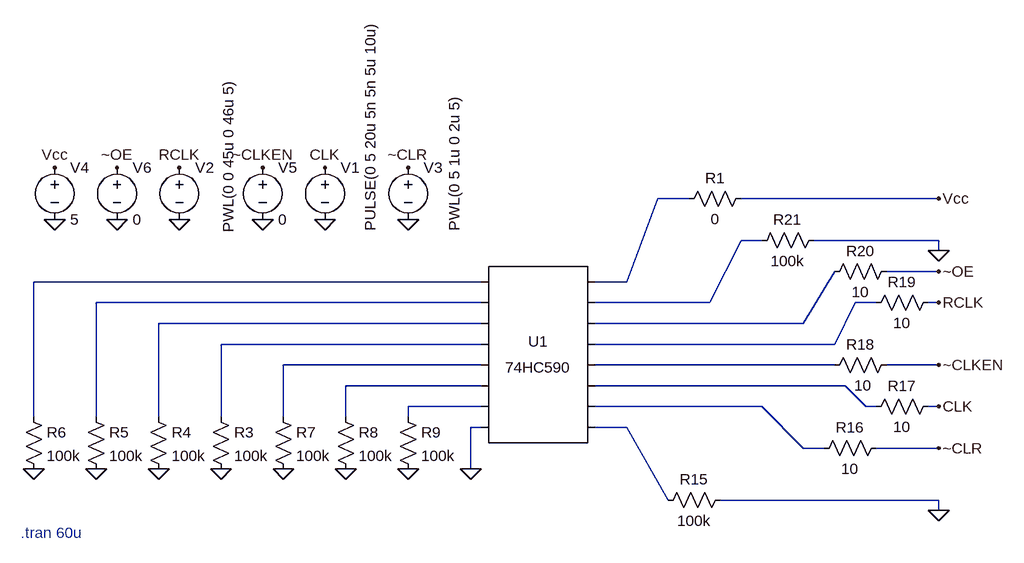
[diagram p0: schematic 74HC590_test.asc]
74HC590_test.asc, the LTspice schematic file:
Version 4
SHEET 1 1240 680
WIRE 368 -80 320 -80
WIRE 752 -80 448 -80
WIRE 480 -16 448 -16
WIRE 752 -16 560 -16
WIRE 752 0 752 -16
WIRE 752 32 672 32
WIRE 48 48 -640 48
WIRE 272 48 320 -80
WIRE 272 48 224 48
WIRE 48 80 -544 80
WIRE 400 80 448 -16
WIRE 400 80 224 80
WIRE 656 80 624 80
WIRE 752 80 736 80
WIRE 48 112 -448 112
WIRE 544 112 592 32
WIRE 544 112 224 112
WIRE 48 144 -352 144
WIRE 592 144 624 80
WIRE 592 144 224 144
WIRE 48 176 -256 176
WIRE 592 176 224 176
WIRE 752 176 672 176
WIRE 48 208 -160 208
WIRE 608 208 224 208
WIRE 48 240 -64 240
WIRE 480 240 224 240
WIRE 640 240 608 208
WIRE 656 240 640 240
WIRE 752 240 736 240
WIRE -640 256 -640 48
WIRE -544 256 -544 80
WIRE -448 256 -448 112
WIRE -352 256 -352 144
WIRE -256 256 -256 176
WIRE -160 256 -160 208
WIRE -64 256 -64 240
WIRE 48 272 32 272
WIRE 272 272 224 272
WIRE 544 304 480 240
WIRE 576 304 544 304
WIRE 752 304 656 304
WIRE 32 336 32 272
WIRE 336 384 272 272
WIRE 752 384 416 384
WIRE 752 400 752 384
FLAG -192 -48 0
FLAG -416 -48 0
FLAG -64 -48 0
FLAG -192 -128 CLK
FLAG 752 240 CLK
FLAG 752 80 RCLK
FLAG -416 -128 RCLK
FLAG 752 304 ~CLR
FLAG -64 -128 ~CLR
FLAG 752 400 0
FLAG -608 -48 0
FLAG -608 -128 Vcc
FLAG 752 -80 Vcc
FLAG 752 0 0
FLAG -352 336 0
FLAG -448 336 0
FLAG -544 336 0
FLAG -640 336 0
FLAG 32 336 0
FLAG -288 -48 0
FLAG -512 -48 0
FLAG -288 -128 ~CLKEN
FLAG 752 176 ~CLKEN
FLAG -512 -128 ~OE
FLAG 752 32 ~OE
FLAG -256 336 0
FLAG -160 336 0
FLAG -64 336 0
SYMBOL voltage -192 -144 R0
WINDOW 3 70 114 VLeft 2
WINDOW 123 0 0 Left 0
WINDOW 39 0 0 Left 0
SYMATTR Value PULSE(0 5 20u 5n 5n 5u 10u)
SYMATTR InstName V1
SYMBOL voltage -416 -144 R0
WINDOW 3 75 116 VLeft 2
WINDOW 123 0 0 Left 0
WINDOW 39 0 0 Left 0
SYMATTR Value PWL(0 0 45u 0 46u 5)
SYMATTR InstName V2
SYMBOL voltage -64 -144 R0
WINDOW 123 0 0 Left 0
WINDOW 39 0 0 Left 0
WINDOW 3 71 114 VLeft 2
SYMATTR Value PWL(0 5 1u 0 2u 5)
SYMATTR InstName V3
SYMBOL res 464 -96 R90
WINDOW 0 0 56 VBottom 2
WINDOW 3 32 56 VTop 2
SYMATTR InstName R1
SYMATTR Value 0
SYMBOL voltage -608 -144 R0
WINDOW 123 0 0 Left 0
WINDOW 39 0 0 Left 0
SYMATTR InstName V4
SYMATTR Value 5
SYMBOL res -368 240 R0
SYMATTR InstName R3
SYMATTR Value 100k
SYMBOL res -464 240 R0
SYMATTR InstName R4
SYMATTR Value 100k
SYMBOL res -560 240 R0
SYMATTR InstName R5
SYMATTR Value 100k
SYMBOL res -656 240 R0
SYMATTR InstName R6
SYMATTR Value 100k
SYMBOL AutoGenerated\\74HC590 128 160 R0
SYMATTR InstName U1
SYMBOL voltage -288 -144 R0
WINDOW 123 0 0 Left 0
WINDOW 39 0 0 Left 0
SYMATTR InstName V5
SYMATTR Value 0
SYMBOL voltage -512 -144 R0
WINDOW 123 0 0 Left 0
WINDOW 39 0 0 Left 0
SYMATTR InstName V6
SYMATTR Value 0
SYMBOL res -272 240 R0
SYMATTR InstName R7
SYMATTR Value 100k
SYMBOL res -176 240 R0
SYMATTR InstName R8
SYMATTR Value 100k
SYMBOL res -80 240 R0
SYMATTR InstName R9
SYMATTR Value 100k
SYMBOL res 432 368 R90
WINDOW 0 0 56 VBottom 2
WINDOW 3 32 56 VTop 2
SYMATTR InstName R15
SYMATTR Value 100k
SYMBOL res 560 320 R270
WINDOW 0 32 56 VTop 2
WINDOW 3 0 56 VBottom 2
SYMATTR InstName R16
SYMATTR Value 10
SYMBOL res 752 224 R90
WINDOW 0 0 56 VBottom 2
WINDOW 3 32 56 VTop 2
SYMATTR InstName R17
SYMATTR Value 10
SYMBOL res 688 160 R90
WINDOW 0 0 56 VBottom 2
WINDOW 3 32 52 VTop 2
SYMATTR InstName R18
SYMATTR Value 10
SYMBOL res 752 64 R90
WINDOW 0 0 56 VBottom 2
WINDOW 3 32 56 VTop 2
SYMATTR InstName R19
SYMATTR Value 10
SYMBOL res 688 16 R90
WINDOW 0 0 56 VBottom 2
WINDOW 3 32 56 VTop 2
SYMATTR InstName R20
SYMATTR Value 10
SYMBOL res 576 -32 R90
WINDOW 0 0 56 VBottom 2
WINDOW 3 32 56 VTop 2
SYMATTR InstName R21
SYMATTR Value 100k
TEXT -660 434 Left 2 ;.tran 60u

The netlist it stands for:
* 74HC590_test.asc
V1 CLK 0 PULSE(0 5 20u 5n 5n 5u 10u)
V2 RCLK 0 PWL(0 0 45u 0 46u 5)
V3 ~CLR 0 PWL(0 5 1u 0 2u 5)
R1 Vcc N001 0
V4 Vcc 0 5
R3 N008 0 100k
R4 N006 0 100k
R5 N004 0 100k
R6 N003 0 100k
* U1: 74HC590 (symbol AutoGenerated\74HC590 not available, pins judged from their places): pin1=N003 pin2=N004 pin3=N006 pin4=N008 pin5=N009 pin6=N011 pin7=N013 pin8=0 pin9=N001 pin10=N002 pin11=N007 pin12=N005 pin13=N010 pin14=N012 pin15=N014 pin16=N015
V5 ~CLKEN 0 0
V6 ~OE 0 0
R7 N009 0 100k
R8 N011 0 100k
R9 N013 0 100k
R15 0 N015 100k
R16 N014 ~CLR 10
R17 CLK N012 10
R18 ~CLKEN N010 10
R19 RCLK N005 10
R20 ~OE N007 10
R21 0 N002 100k
* .tran 60u
.backanno
.end